# Altium schematic sheet SD Holder.SchDoc
size A4
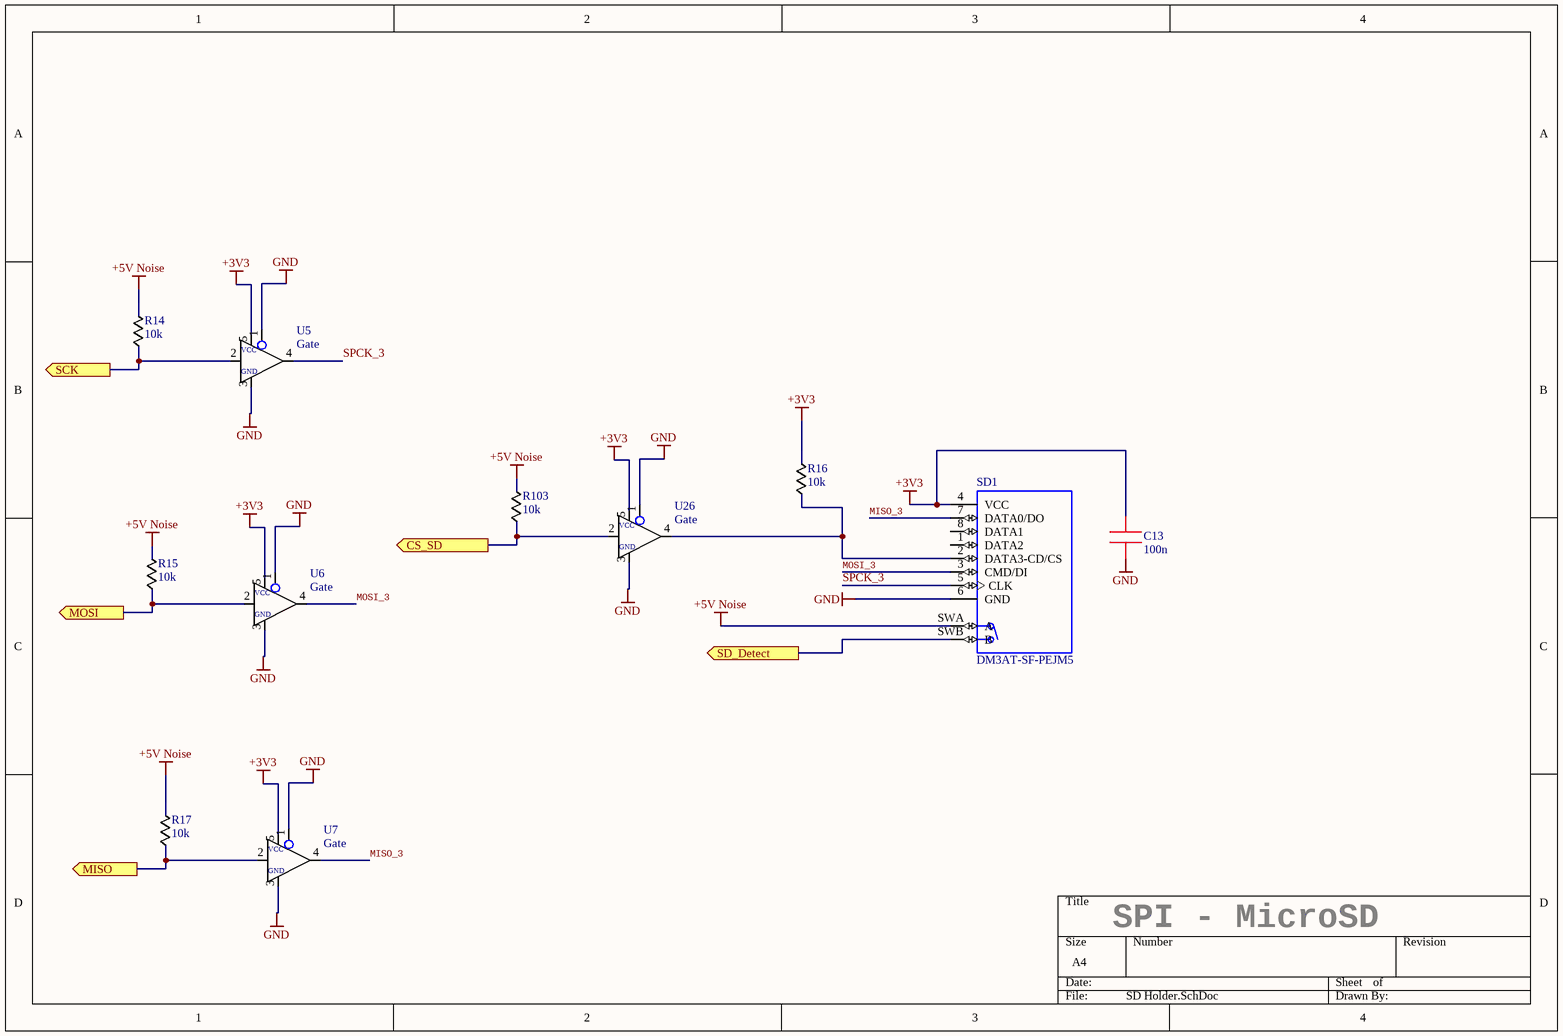
[diagram p0: SD Holder.SchDoc]

## Parts
C13  100n  [0603]
R14  10k  [0603]
R15  10k  [0603]
R16  10k  [0603]
R17  10k  [0603]
R103  10k  [0603]
SD1  DM3AT-SF-PEJM5  [DM3AT-SF-PEJM5]
U5  Gate  [SOT23 - 5 lead]
U6  Gate  [SOT23 - 5 lead]
U7  Gate  [SOT23 - 5 lead]
U26  Gate  [SOT23 - 5 lead]

## Ports
CS_SD, MISO, MOSI, SCK, SD_Detect (out)

## Nets
+3V3: C13.2 R16.2 SD1.4(VCC) U5.5 U6.5 U7.5 U26.5
+5V Noise: R14.2 R15.2 R17.2 R103.2 SD1.SWA(A)
GND: C13.1 SD1.6(GND) U5.1 U5.3 U6.1 U6.3 U7.1 U7.3 U26.1 U26.3
CS_SD: R103.1 U26.2 ; port CS_SD
MISO: R17.1 U7.2 ; port MISO
MISO_3: SD1.7(DATA0/DO) U7.4
MOSI: R15.1 U6.2 ; port MOSI
MOSI_3: SD1.3(CMD/DI) U6.4
SCK: R14.1 U5.2 ; port SCK
SD_Detect: SD1.SWB(B) ; port SD_Detect
SPCK_3: SD1.5(CLK) U5.4
NetR16_1: R16.1 SD1.2(DATA3-CD/CS) U26.4

Not connected (* = marked no-connect by the designer): SD1 1(DATA2) 8(DATA1)

## Notes on the sheet
- SPI - MicroSD
- (in symbol Gate) VCC; GND

## Library data of the parts
C13 = 0603 CAP: CC0603KRX7R9BB104
R14-R17 R103 = 0603 RES: RT0603FRE0710KL
U5-U7 U26 = Gate: SN74LVC1G125DBVR